# Altium project stm32_mobo_module.PrjPcb
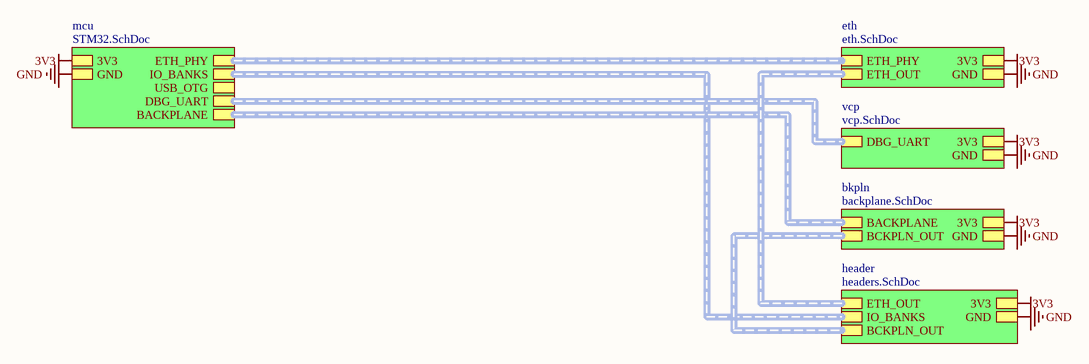
[diagram p0: main.SchDoc]
6 sheets, 84 parts. Net scope: strictly hierarchical (ports join the sheet entries above them; power ports are local).
Board file: main.PcbDoc
Sheets:
  main.SchDoc
    mcu = STM32.SchDoc
    eth = eth.SchDoc
    vcp = vcp.SchDoc
    bkpln = backplane.SchDoc
    header = headers.SchDoc

## Sheet main.SchDoc
size A

### Sub-sheets
bkpln = backplane.SchDoc: 3V3, GND, BACKPLANE (harness BACKPLANE), BCKPLN_OUT (harness BCKPLN_OUT)
eth = eth.SchDoc: ETH_PHY (harness ETH_PHY), 3V3, GND, ETH_OUT (harness ETH_OUT)
header = headers.SchDoc: ETH_OUT (harness ETH_OUT), IO_BANKS (harness IO_BANKS), 3V3, GND, BCKPLN_OUT (harness BCKPLN_OUT)
mcu = STM32.SchDoc: BACKPLANE (harness BACKPLANE), ETH_PHY (harness ETH_PHY), IO_BANKS (harness IO_BANKS), USB_OTG (harness USB_OTG), DBG_UART (harness UART), 3V3, GND
vcp = vcp.SchDoc: 3V3, GND, DBG_UART (harness UART)

### Nets
3V3: sheet mcu/3V3, sheet eth/3V3, sheet vcp/3V3, sheet bkpln/3V3, sheet header/3V3
GND: sheet mcu/GND, sheet eth/GND, sheet vcp/GND, sheet bkpln/GND, sheet header/GND

### Buses and harness runs
harness sheet bkpln/BACKPLANE = sheet mcu/BACKPLANE
harness sheet bkpln/BCKPLN_OUT = sheet header/BCKPLN_OUT
harness sheet eth/ETH_OUT = sheet header/ETH_OUT
harness sheet eth/ETH_PHY = sheet mcu/ETH_PHY
harness sheet header/IO_BANKS = sheet mcu/IO_BANKS
harness sheet mcu/DBG_UART = sheet vcp/DBG_UART

## Sheet STM32.SchDoc
size B
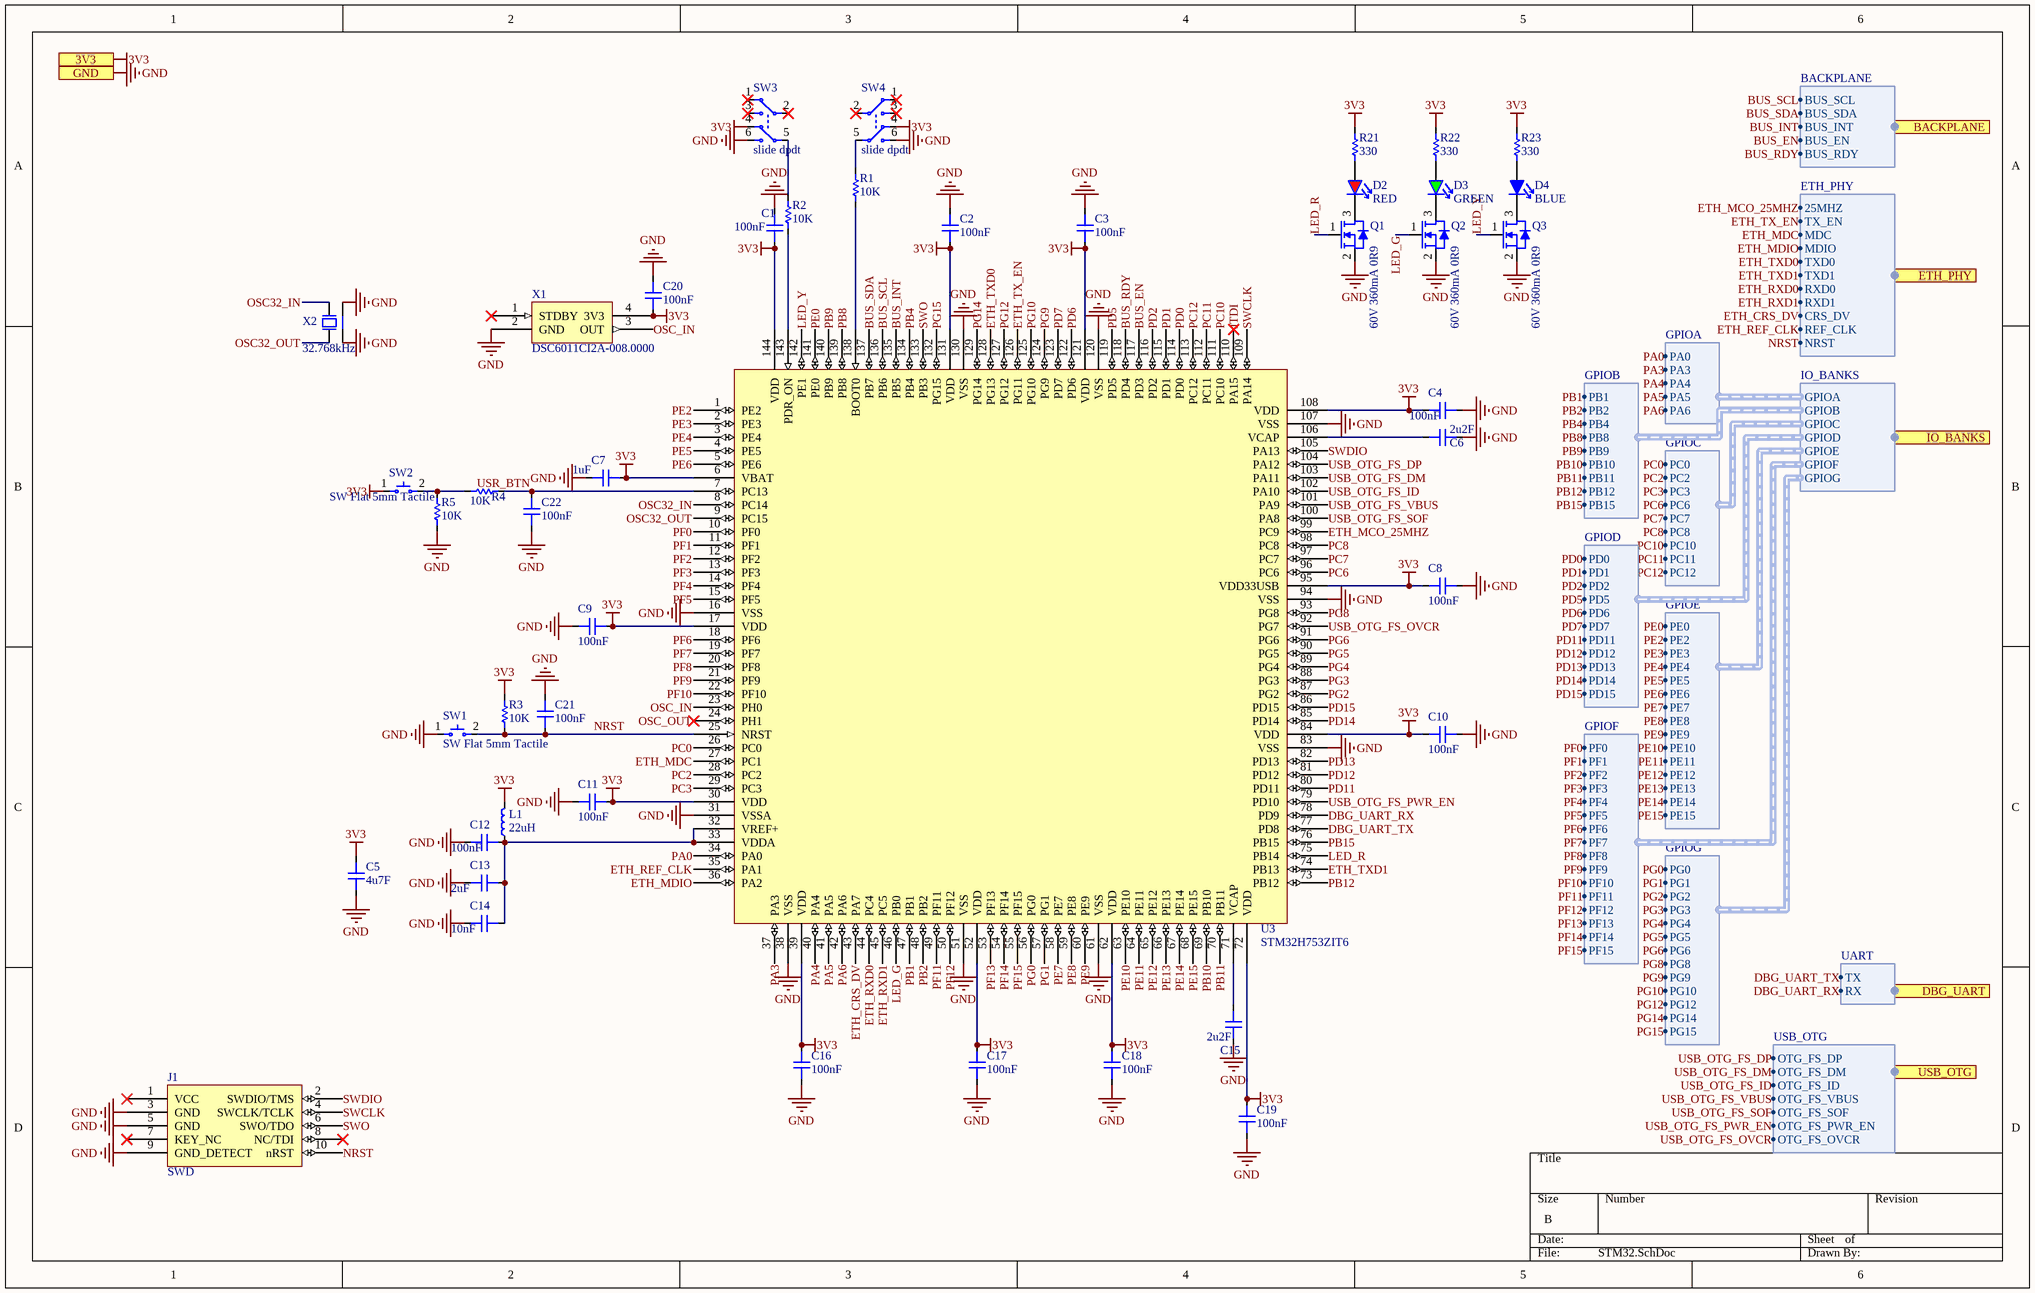
[diagram p1: STM32.SchDoc]

### Parts
C1  100nF  [CAP 0805 L]
C2  100nF  [CAP 0805 L]
C3  100nF  [CAP 0805 L]
C4  100nF  [CAP 0805 L]
C5  4u7F  [CAP 0805 L]
C6  2u2F  [CAP 0805 L]
C7  1uF  [CAP 0805 L]
C8  100nF  [CAP 0805 L]
C9  100nF  [CAP 0805 L]
C10  100nF  [CAP 0805 L]
C11  100nF  [CAP 0805 L]
C12  100nF  [CAP 0805 L]
C13  2uF  [CAP 0805 L]
C14  10nF  [CAP 0805 L]
C15  2u2F  [CAP 0805 L]
C16  100nF  [CAP 0805 L]
C17  100nF  [CAP 0805 L]
C18  100nF  [CAP 0805 L]
C19  100nF  [CAP 0805 L]
C20  100nF  [CAP 0805 L]
C21  100nF  [CAP 0805 L]
C22  100nF  [CAP 0805 L]
D2  RED  [LED 0603 RED]
D3  GREEN  [LED 0603 GREEN]
D4  BLUE  [LED 0603 BLUE]
J1  SWD  [CONN IDC 10P P0.05]
L1  22uH  [IND 0805 L]
Q1  60V 360mA 0R9  [SOT23]
Q2  60V 360mA 0R9  [SOT23]
Q3  60V 360mA 0R9  [SOT23]
R1  10K  [RES 0603 L]
R2  10K  [RES 0603 L]
R3  10K  [RES 0603 L]
R4  10K  [RES 0603 L]
R5  10K  [RES 0603 L]
R21  330  [RES 0603 L]
R22  330  [RES 0603 L]
R23  330  [RES 0603 L]
SW1  SW Flat 5mm Tactile  [SW 5MM TACTILE]
SW2  SW Flat 5mm Tactile  [SW 5MM TACTILE]
SW3  slide dpdt  [SW SIDE SLIDE DPDT]
SW4  slide dpdt  [SW SIDE SLIDE DPDT]
U3  STM32H753ZIT6  [LQFP144]
X1  DSC6011CI2A-008.0000  [XO 3.2x2.5]
X2  32.768kHz  [XTAL 8.0x3.8]

### Ports
3V3, BACKPLANE (harness BACKPLANE), DBG_UART (harness UART), ETH_PHY (harness ETH_PHY), GND, IO_BANKS (harness IO_BANKS), USB_OTG (harness USB_OTG)

### Harnesses
BACKPLANE: BUS_SCL, BUS_SDA, BUS_INT, BUS_EN, BUS_RDY
ETH_PHY: 25MHZ, TX_EN, MDC, MDIO, TXD0, TXD1, RXD0, RXD1, CRS_DV, REF_CLK, NRST
IO_BANKS: GPIOA, GPIOB, GPIOC, GPIOD, GPIOE, GPIOF, GPIOG
GPIOA: PA0, PA3, PA4, PA5, PA6
GPIOB: PB1, PB2, PB4, PB8, PB9, PB10, PB11, PB12, PB15
GPIOC: PC0, PC2, PC3, PC6, PC7, PC8, PC10, PC11, PC12
GPIOD: PD0, PD1, PD2, PD5, PD6, PD7, PD11, PD12, PD13, PD14, PD15
GPIOE: PE0, PE2, PE3, PE4, PE5, PE6, PE7, PE8, PE9, PE10, PE11, PE12, PE13, PE14, PE15
GPIOF: PF0, PF1, PF2, PF3, PF4, PF5, PF6, PF7, PF8, PF9, PF10, PF11, PF12, PF13, PF14, PF15
GPIOG: PG0, PG1, PG2, PG3, PG4, PG5, PG6, PG8, PG9, PG10, PG12, PG14, PG15
USB_OTG: OTG_FS_DP, OTG_FS_DM, OTG_FS_ID, OTG_FS_VBUS, OTG_FS_SOF, OTG_FS_PWR_EN, OTG_FS_OVCR
UART: TX, RX

### Nets
3V3: C1.1 C2.1 C3.1 C4.1 C5.1 C7.2 C8.1 C9.2 C10.1 C11.2 C16.2 C17.2 C18.2 C19.2 C20.1 L1.2 R3.2 R21.2 R22.2 R23.2 SW2.1 SW3.4 SW4.4 U3.6(VBAT) U3.17(VDD) U3.30(VDD) U3.39(VDD) U3.52(VDD) U3.62(VDD) U3.72(VDD) U3.84(VDD) U3.95(VDD33USB) U3.108(VDD) U3.121(VDD) U3.131(VDD) U3.144(VDD) X1.4(3V3) ; port 3V3
GND: C1.2 C2.2 C3.2 C4.2 C5.2 C6.2 C7.1 C8.2 C9.1 C10.2 C11.1 C12.1 C13.1 C14.1 C15.1 C16.1 C17.1 C18.1 C19.1 C20.2 C21.2 C22.1 J1.3(GND) J1.5(GND) J1.9(GND_DETECT) Q1.2 Q2.2 Q3.2 R5.1 SW1.1 SW3.6 SW4.6 U3.16(VSS) U3.31(VSSA) U3.38(VSS) U3.51(VSS) U3.61(VSS) U3.83(VSS) U3.94(VSS) U3.107(VSS) U3.120(VSS) U3.130(VSS) X1.2(GND) X2.2 X2.3 ; port GND
BUS_EN: U3.117(PD3) ; port BACKPLANE.BUS_EN
BUS_INT: U3.135(PB5) ; port BACKPLANE.BUS_INT
BUS_RDY: U3.118(PD4) ; port BACKPLANE.BUS_RDY
BUS_SCL: U3.136(PB6) ; port BACKPLANE.BUS_SCL
BUS_SDA: U3.137(PB7) ; port BACKPLANE.BUS_SDA
DBG_UART_RX: U3.78(PD9) ; port DBG_UART.RX
DBG_UART_TX: U3.77(PD8) ; port DBG_UART.TX
ETH_CRS_DV: U3.43(PA7) ; port ETH_PHY.CRS_DV  [project net CRS_DV]
ETH_MCO_25MHZ: U3.99(PC9) ; port ETH_PHY.25MHZ  [project net 25MHZ]
ETH_MDC: U3.27(PC1) ; port ETH_PHY.MDC
ETH_MDIO: U3.36(PA2) ; port ETH_PHY.MDIO
ETH_REF_CLK: U3.35(PA1) ; port ETH_PHY.REF_CLK
ETH_RXD0: U3.44(PC4) ; port ETH_PHY.RXD0
ETH_RXD1: U3.45(PC5) ; port ETH_PHY.RXD1
ETH_TX_EN: U3.126(PG11) ; port ETH_PHY.TX_EN
ETH_TXD0: U3.128(PG13) ; port ETH_PHY.TXD0
ETH_TXD1: U3.74(PB13) ; port ETH_PHY.TXD1
JTDI: U3.110(PA15)
LED_G: Q2.1 U3.46(PB0)
LED_R: Q1.1 U3.75(PB14)
LED_Y: Q3.1 U3.142(PE1)
NRST: C21.1 J1.10(nRST) R3.1 SW1.2 U3.25(NRST) ; port ETH_PHY.NRST
OSC32_IN: U3.8(PC14) X2.4
OSC32_OUT: U3.9(PC15) X2.1
OSC_IN: U3.23(PH0) X1.3(OUT)
OSC_OUT: U3.24(PH1)
PA0: U3.34(PA0) ; harness GPIOA.PA0
PA3: U3.37(PA3) ; harness GPIOA.PA3
PA4: U3.40(PA4) ; harness GPIOA.PA4
PA5: U3.41(PA5) ; harness GPIOA.PA5
PA6: U3.42(PA6)
PB1: U3.47(PB1) ; harness GPIOB.PB1
PB2: U3.48(PB2) ; harness GPIOB.PB2
PB4: U3.134(PB4) ; harness GPIOB.PB4
PB8: U3.139(PB8) ; harness GPIOB.PB8
PB9: U3.140(PB9) ; harness GPIOB.PB9
PB10: U3.69(PB10) ; harness GPIOB.PB10
PB11: U3.70(PB11) ; harness GPIOB.PB11
PB12: U3.73(PB12) ; harness GPIOB.PB12
PB15: U3.76(PB15) ; harness GPIOB.PB15
PC0: U3.26(PC0) ; harness GPIOC.PC0
PC2: U3.28(PC2) ; harness GPIOC.PC2
PC3: U3.29(PC3) ; harness GPIOC.PC3
PC6: U3.96(PC6) ; harness GPIOC.PC6
PC7: U3.97(PC7) ; harness GPIOC.PC7
PC8: U3.98(PC8) ; harness GPIOC.PC8
PC10: U3.111(PC10) ; harness GPIOC.PC10
PC11: U3.112(PC11) ; harness GPIOC.PC11
PC12: U3.113(PC12) ; harness GPIOC.PC12
PD0: U3.114(PD0) ; harness GPIOD.PD0
PD1: U3.115(PD1) ; harness GPIOD.PD1
PD2: U3.116(PD2) ; harness GPIOD.PD2
PD5: U3.119(PD5) ; harness GPIOD.PD5
PD6: U3.122(PD6) ; harness GPIOD.PD6
PD7: U3.123(PD7) ; harness GPIOD.PD7
PD11: U3.80(PD11) ; harness GPIOD.PD11
PD12: U3.81(PD12) ; harness GPIOD.PD12
PD13: U3.82(PD13) ; harness GPIOD.PD13
PD14: U3.85(PD14) ; harness GPIOD.PD14
PD15: U3.86(PD15) ; harness GPIOD.PD15
PE0: U3.141(PE0) ; harness GPIOE.PE0
PE2: U3.1(PE2) ; harness GPIOE.PE2
PE3: U3.2(PE3) ; harness GPIOE.PE3
PE4: U3.3(PE4) ; harness GPIOE.PE4
PE5: U3.4(PE5) ; harness GPIOE.PE5
PE6: U3.5(PE6) ; harness GPIOE.PE6
PE7: U3.58(PE7) ; harness GPIOE.PE7
PE8: U3.59(PE8) ; harness GPIOE.PE8
PE9: U3.60(PE9) ; harness GPIOE.PE9
PE10: U3.63(PE10) ; harness GPIOE.PE10
PE11: U3.64(PE11) ; harness GPIOE.PE11
PE12: U3.65(PE12) ; harness GPIOE.PE12
PE13: U3.66(PE13) ; harness GPIOE.PE13
PE14: U3.67(PE14) ; harness GPIOE.PE14
PE15: U3.68(PE15) ; harness GPIOE.PE15
PF0: U3.10(PF0) ; harness GPIOF.PF0
PF1: U3.11(PF1) ; harness GPIOF.PF1
PF2: U3.12(PF2) ; harness GPIOF.PF2
PF3: U3.13(PF3) ; harness GPIOF.PF3
PF4: U3.14(PF4) ; harness GPIOF.PF4
PF5: U3.15(PF5) ; harness GPIOF.PF5
PF6: U3.18(PF6) ; harness GPIOF.PF6
PF7: U3.19(PF7) ; harness GPIOF.PF7
PF8: U3.20(PF8) ; harness GPIOF.PF8
PF9: U3.21(PF9) ; harness GPIOF.PF9
PF10: U3.22(PF10) ; harness GPIOF.PF10
PF11: U3.49(PF11) ; harness GPIOF.PF11
PF12: U3.50(PF12) ; harness GPIOF.PF12
PF13: U3.53(PF13) ; harness GPIOF.PF13
PF14: U3.54(PF14) ; harness GPIOF.PF14
PF15: U3.55(PF15) ; harness GPIOF.PF15
PG0: U3.56(PG0) ; harness GPIOG.PG0
PG1: U3.57(PG1) ; harness GPIOG.PG1
PG2: U3.87(PG2) ; harness GPIOG.PG2
PG3: U3.88(PG3) ; harness GPIOG.PG3
PG4: U3.89(PG4) ; harness GPIOG.PG4
PG5: U3.90(PG5) ; harness GPIOG.PG5
PG6: U3.91(PG6) ; harness GPIOG.PG6
PG8: U3.93(PG8) ; harness GPIOG.PG8
PG9: U3.124(PG9) ; harness GPIOG.PG9
PG10: U3.125(PG10) ; harness GPIOG.PG10
PG12: U3.127(PG12) ; harness GPIOG.PG12
PG14: U3.129(PG14) ; harness GPIOG.PG14
PG15: U3.132(PG15) ; harness GPIOG.PG15
SWCLK: J1.4(SWCLK/TCLK) U3.109(PA14)
SWDIO: J1.2(SWDIO/TMS) U3.105(PA13)
SWO: J1.6(SWO/TDO) U3.133(PB3)
USB_OTG_FS_DM: U3.103(PA11) ; port USB_OTG.OTG_FS_DM
USB_OTG_FS_DP: U3.104(PA12) ; port USB_OTG.OTG_FS_DP
USB_OTG_FS_ID: U3.102(PA10) ; port USB_OTG.OTG_FS_ID
USB_OTG_FS_OVCR: U3.92(PG7) ; port USB_OTG.OTG_FS_OVCR
USB_OTG_FS_PWR_EN: U3.79(PD10) ; port USB_OTG.OTG_FS_PWR_EN
USB_OTG_FS_SOF: U3.100(PA8) ; port USB_OTG.OTG_FS_SOF
USB_OTG_FS_VBUS: U3.101(PA9) ; port USB_OTG.OTG_FS_VBUS
USR_BTN: C22.2 R4.1 U3.7(PC13)
NetC6_1: C6.1 U3.106(VCAP)
NetC12_2: C12.2 C13.2 C14.2 L1.1 U3.32(VREF+) U3.33(VDDA)
NetC15_2: C15.2 U3.71(VCAP)
NetD2_1: D2.1 Q1.3
NetD2_2: D2.2 R21.1
NetD3_1: D3.1 Q2.3
NetD3_2: D3.2 R22.1
NetD4_1: D4.1 Q3.3
NetD4_2: D4.2 R23.1
NetR1_1: R1.1 U3.138(BOOT0)
NetR1_2: R1.2 SW4.5
NetR2_1: R2.1 U3.143(PDR_ON)
NetR2_2: R2.2 SW3.5
NetR4_2: R4.2 R5.2 SW2.2

Not connected (* = marked no-connect by the designer): J1 1(VCC)* 7(KEY_NC)* 8(NC/TDI)*; SW3 1* 2* 3*; SW4 1* 2* 3*; X1 1(STDBY)*

### Notes on the sheet
- Labels drawn without touching a wire or pin: PA6

### Library data of the parts
C1-C22 = CAP 0805
D2 = LED 0603 RED
D3 = LED 0603 GREEN
D4 = LED 0603 BLUE
J1 = CONN SWD IDC 0.05: Supplier 1: Digi-Key; Supplier Part Number 1: 1175-1735-ND
L1 = IND 0805
Q1-Q3 = FET 60V 360mA 0R9: PMN20ENAX; Supplier 1: Digi-Key; Supplier Part Number 1: 1727-1142-1-ND
R1-R5 R21-R23 = RES 0603
SW3 SW4 = SW horz slide dpdt: JS202011JAQN; Supplier 1: Digi-Key; Supplier Part Number 1: CKN10722CT-ND
X1 = XO MEMS 8MHz
X2 = XTAL 32.768kHz: RSM200S-32.768-12.5-10PPM-NPB

## Sheet eth.SchDoc
size A
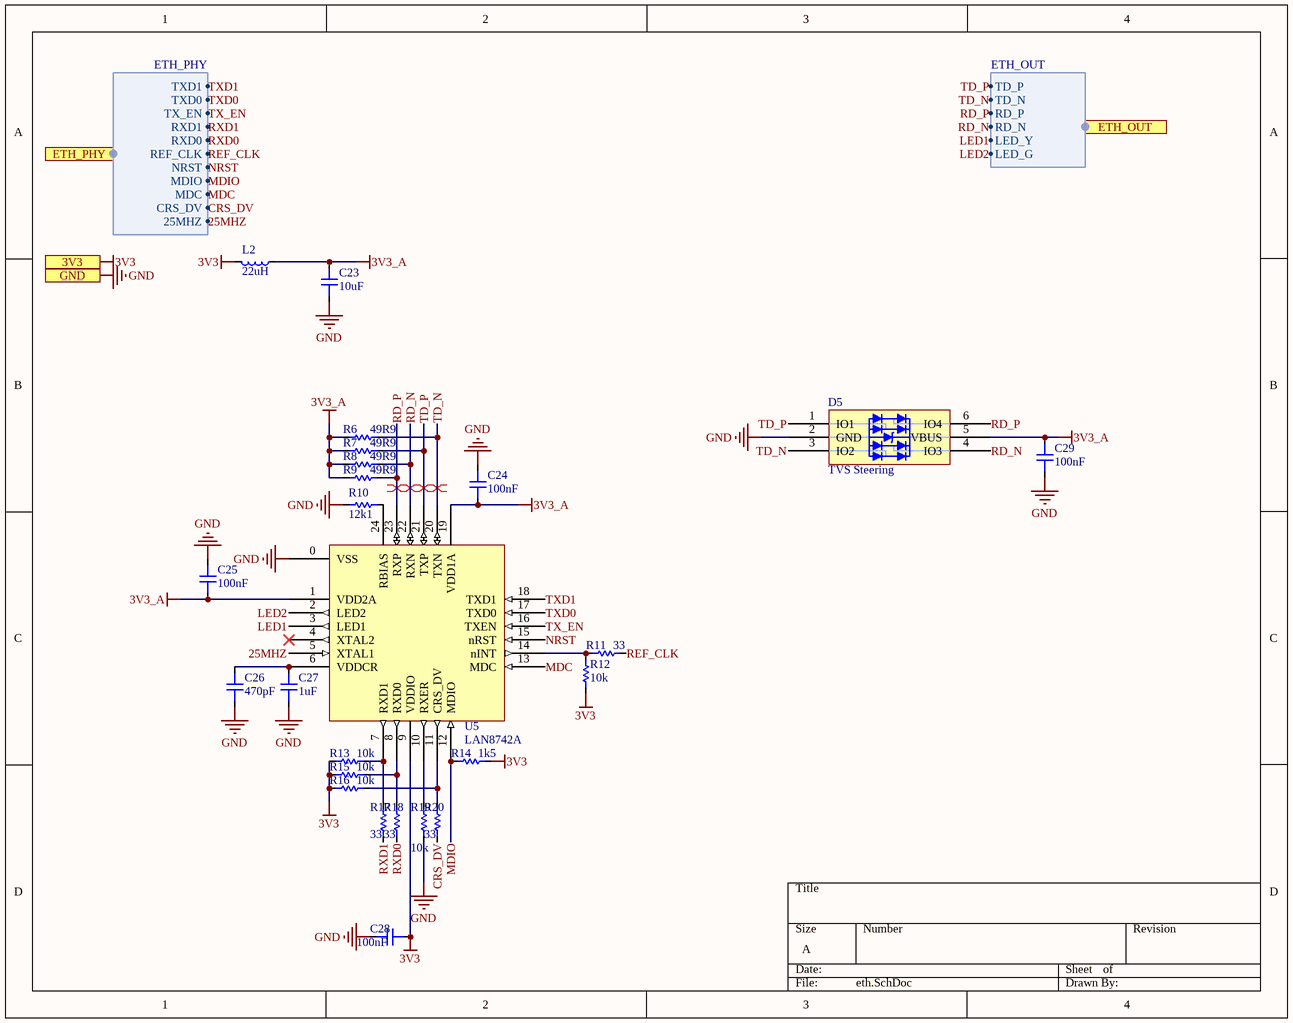
[diagram p2: eth.SchDoc]

### Parts
C23  10uF  [CAP 0805 L]
C24  100nF  [CAP 0805 L]
C25  100nF  [CAP 0805 L]
C26  470pF  [CAP 0805 L]
C27  1uF  [CAP 0805 L]
C28  100nF  [CAP 0805 L]
C29  100nF  [CAP 0805 L]
D5  TVS Steering  [SC-74]
L2  22uH  [IND 0805 L]
R6  49R9  [RES 0603 L]
R7  49R9  [RES 0603 L]
R8  49R9  [RES 0603 L]
R9  49R9  [RES 0603 L]
R10  12k1  [RES 0603 L]
R11  33  [RES 0603 L]
R12  10k  [RES 0603 L]
R13  10k  [RES 0603 L]
R14  1k5  [RES 0603 L]
R15  10k  [RES 0603 L]
R16  10k  [RES 0603 L]
R17  33  [RES 0603 L]
R18  33  [RES 0603 L]
R19  10k  [RES 0603 L]
R20  33  [RES 0603 L]
U5  LAN8742A  [VQFN24]

### Ports
3V3, ETH_OUT (harness ETH_OUT), ETH_PHY (harness ETH_PHY), GND

### Harnesses
ETH_PHY: 25MHZ, CRS_DV, MDC, MDIO, NRST, REF_CLK, RXD0, RXD1, TX_EN, TXD0, TXD1
ETH_OUT: TD_P, TD_N, RD_P, RD_N, LED_Y, LED_G

### Nets
3V3: C28.2 L2.2 R12.2 R13.2 R14.1 R15.2 R16.2 U5.9(VDDIO) ; port 3V3
3V3_A: C23.2 C24.1 C25.1 C29.2 D5.5(VBUS) L2.1 R6.2 R7.2 R8.2 R9.2 U5.1(VDD2A) U5.19(VDD1A)
GND: C23.1 C24.2 C25.2 C26.1 C27.1 C28.1 C29.1 D5.2(GND) R10.1 R19.1 U5.0(VSS) ; port GND
25MHZ: U5.5(XTAL1) ; port ETH_PHY.25MHZ
CRS_DV: R20.1 ; port ETH_PHY.CRS_DV
LED1: U5.3(LED1) ; port ETH_OUT.LED_Y
LED2: U5.2(LED2) ; port ETH_OUT.LED_G
MDC: U5.13(MDC) ; port ETH_PHY.MDC  [project net ETH_MDC]
MDIO: R14.2 U5.12(MDIO) ; port ETH_PHY.MDIO  [project net ETH_MDIO]
NRST: U5.15(nRST) ; port ETH_PHY.NRST
RD_N: D5.4(IO3) R8.1 U5.22(RXN) ; port ETH_OUT.RD_N
RD_P: D5.6(IO4) R9.1 U5.23(RXP) ; port ETH_OUT.RD_P
REF_CLK: R11.1 ; port ETH_PHY.REF_CLK  [project net ETH_REF_CLK]
RXD0: R18.1 ; port ETH_PHY.RXD0  [project net ETH_RXD0]
RXD1: R17.1 ; port ETH_PHY.RXD1  [project net ETH_RXD1]
TD_N: D5.3(IO2) R6.1 U5.20(TXN) ; port ETH_OUT.TD_N
TD_P: D5.1(IO1) R7.1 U5.21(TXP) ; port ETH_OUT.TD_P
TX_EN: U5.16(TXEN) ; port ETH_PHY.TX_EN  [project net ETH_TX_EN]
TXD0: U5.17(TXD0) ; port ETH_PHY.TXD0  [project net ETH_TXD0]
TXD1: U5.18(TXD1) ; port ETH_PHY.TXD1  [project net ETH_TXD1]
NetC26_2: C26.2 C27.2 U5.6(VDDCR)
NetR10_2: R10.2 U5.24(RBIAS)
NetR11_2: R11.2 R12.1 U5.14(nINT)
NetR13_1: R13.1 R17.2 U5.7(RXD1)
NetR15_1: R15.1 R18.2 U5.8(RXD0)
NetR16_1: R16.1 R20.2 U5.11(CRS_DV)
NetR19_2: R19.2 U5.10(RXER)

Not connected (* = marked no-connect by the designer): U5 4(XTAL2)*

### Layout directives
differential pair: RD_N, RD_P, TD_N, TD_P

### Library data of the parts
C23-C29 = CAP 0805
D5 = DTVS 2Rail 4x: CM1293A-04SO; Supplier 1: Digi-Key; Supplier Part Number 1: CM1293A-04SOOSCT-ND
L2 = IND 0805
R6-R20 = RES 0603
U5 = IC ETH PHY RMII: LAN8742A-CZ-TR / LAN8742AI-CZ-TR

## Sheet vcp.SchDoc
size A
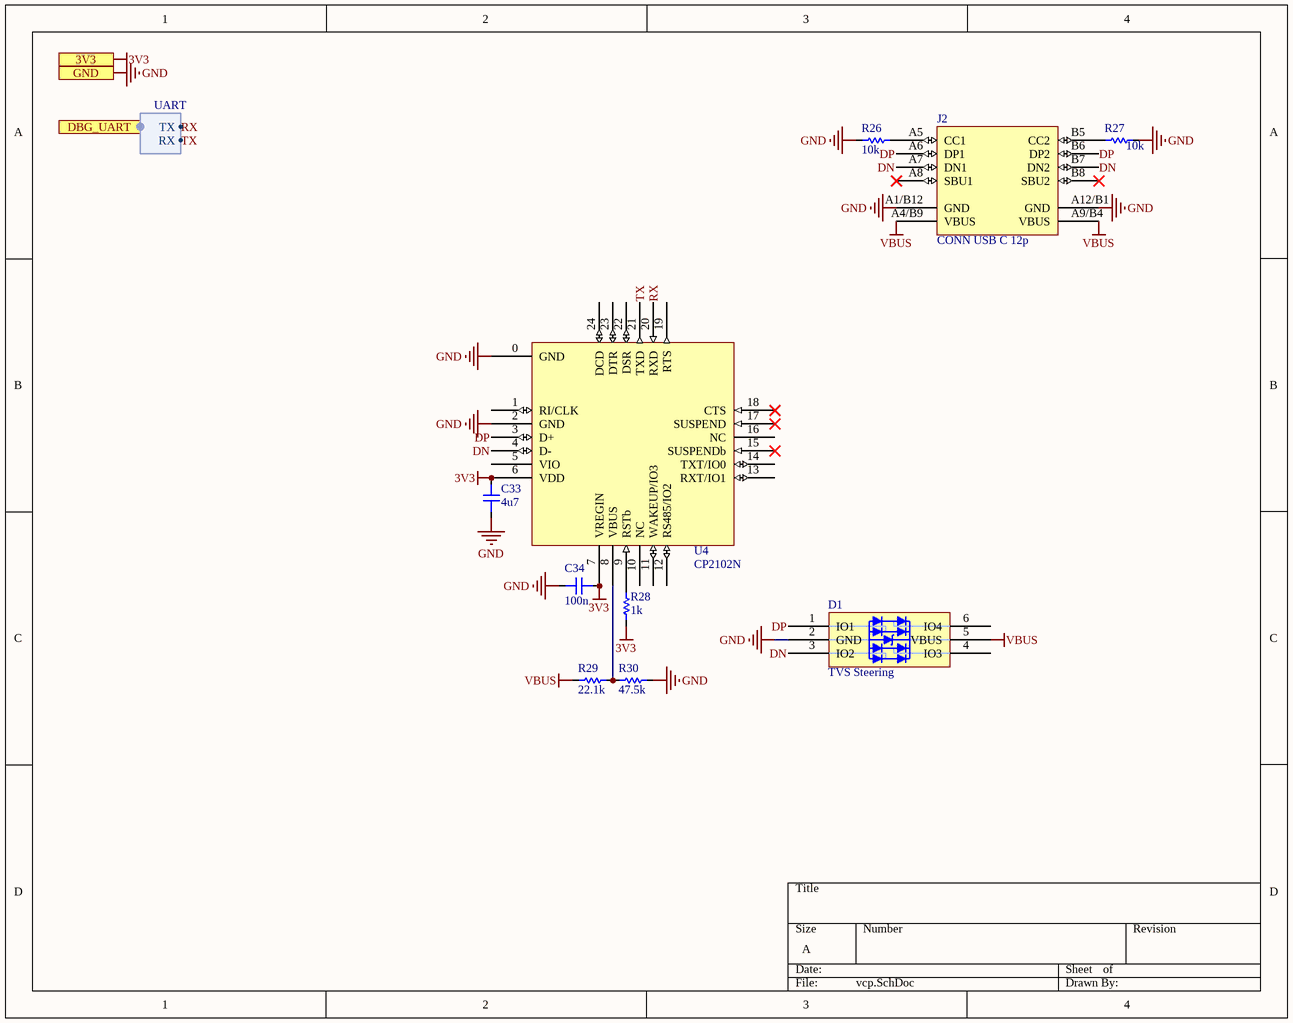
[diagram p3: vcp.SchDoc]

### Parts
C33  4u7  [CAP 0805 L]
C34  100n  [CAP 0805 L]
D1  TVS Steering  [SC-74]
J2  CONN USB C 12p  [CONN USB C 12P]
R26  10k  [RES 0603 L]
R27  10k  [RES 0603 L]
R28  1k  [RES 0603 L]
R29  22.1k  [RES 0603 L]
R30  47.5k  [RES 0603 L]
U4  CP2102N  [VQFN24]

### Ports
3V3, DBG_UART (harness UART), GND

### Harnesses
UART: RX, TX

### Nets
3V3: C33.2 C34.2 R28.1 U4.6(VDD) U4.7(VREGIN) ; port 3V3
GND: C33.1 C34.1 D1.2(GND) J2.A1/B12(GND) J2.A12/B1(GND) R26.2 R27.1 R30.2 U4.0(GND) U4.2(GND) ; port GND
VBUS: D1.5(VBUS) J2.A4/B9(VBUS) J2.A9/B4(VBUS) R29.1
DN: D1.3(IO2) J2.A7(DN1) J2.B7(DN2) U4.4(D-)
DP: D1.1(IO1) J2.A6(DP1) J2.B6(DP2) U4.3(D+)
RX: U4.20(RXD) ; port DBG_UART.TX  [project net DBG_UART_TX]
TX: U4.21(TXD) ; port DBG_UART.RX  [project net DBG_UART_RX]
NetJ2_A5: J2.A5(CC1) R26.1
NetJ2_B5: J2.B5(CC2) R27.2
NetR28_2: R28.2 U4.9(RSTb)
NetR29_2: R29.2 R30.1 U4.8(VBUS)

Not connected (* = marked no-connect by the designer): D1 4(IO3) 6(IO4); J2 A8(SBU1)* B8(SBU2)*; U4 1(RI/CLK) 5(VIO) 10(NC) 11(WAKEUP/IO3) 12(RS485/IO2) 13(RXT/IO1) 14(TXT/IO0) 15(SUSPENDb)* 16(NC) 17(SUSPEND)* 18(CTS)* 19(RTS) 22(DSR) 23(DTR) 24(DCD)

### Library data of the parts
C33 C34 = CAP 0805
D1 = DTVS 2Rail 4x: CM1293A-04SO; Supplier 1: Digi-Key; Supplier Part Number 1: CM1293A-04SOOSCT-ND
J2 = CONN USB C 12p: USB - Type C Female 12 SMD USB Connectors RoHS; LCSC Part #: C167321
R26-R30 = RES 0603
U4 = IC USB UART CP2102N: Supplier 1: Digi-Key; Supplier Part Number 1: 336-5888-1-ND

## Sheet backplane.SchDoc
size A
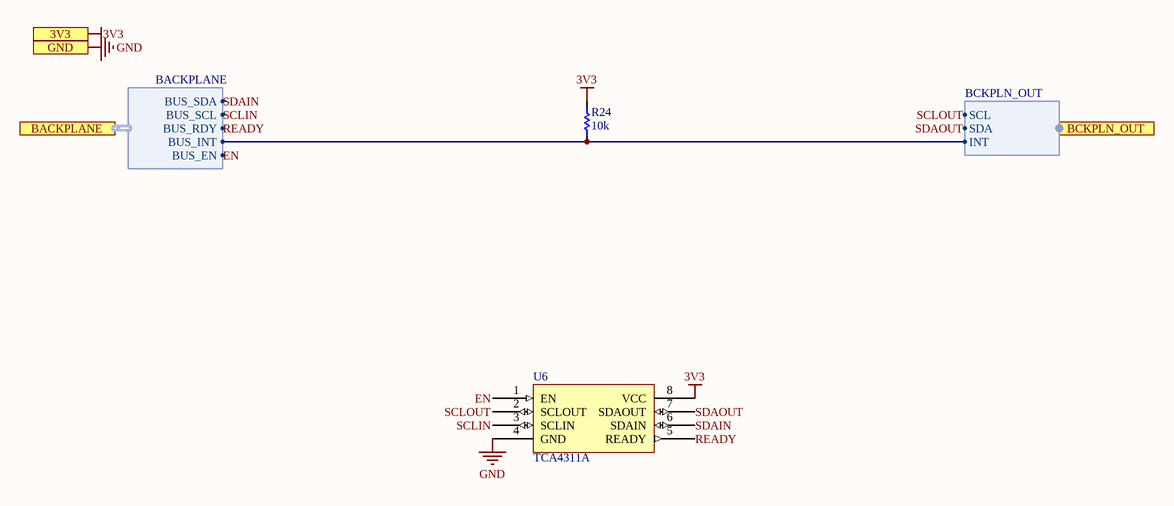
[diagram p4: backplane.SchDoc]

### Parts
R24  10k  [RES 0603 L]
U6  TCA4311A  [SSOP-8]

### Ports
3V3, BACKPLANE (harness BACKPLANE), BCKPLN_OUT (harness BCKPLN_OUT), GND

### Harnesses
BACKPLANE: BUS_EN, BUS_INT, BUS_RDY, BUS_SCL, BUS_SDA
BCKPLN_OUT: SCL, SDA, INT

### Nets
3V3: R24.2 U6.8(VCC) ; port 3V3
GND: U6.4(GND) ; port GND
BUS_INT: R24.1 ; port BACKPLANE.BUS_INT, port BCKPLN_OUT.INT
EN: U6.1(EN) ; port BACKPLANE.BUS_EN  [project net BUS_EN]
READY: U6.5(READY) ; port BACKPLANE.BUS_RDY  [project net BUS_RDY]
SCLIN: U6.3(SCLIN) ; port BACKPLANE.BUS_SCL  [project net BUS_SCL]
SCLOUT: U6.2(SCLOUT) ; port BCKPLN_OUT.SCL
SDAIN: U6.6(SDAIN) ; port BACKPLANE.BUS_SDA  [project net BUS_SDA]
SDAOUT: U6.7(SDAOUT) ; port BCKPLN_OUT.SDA

### Library data of the parts
R24 = RES 0603
U6 = IC I2C HOTSWAP BUF: Supplier 1: Digi-Key; Supplier Part Number 1: 296-28328-1-ND

## Sheet headers.SchDoc
size A
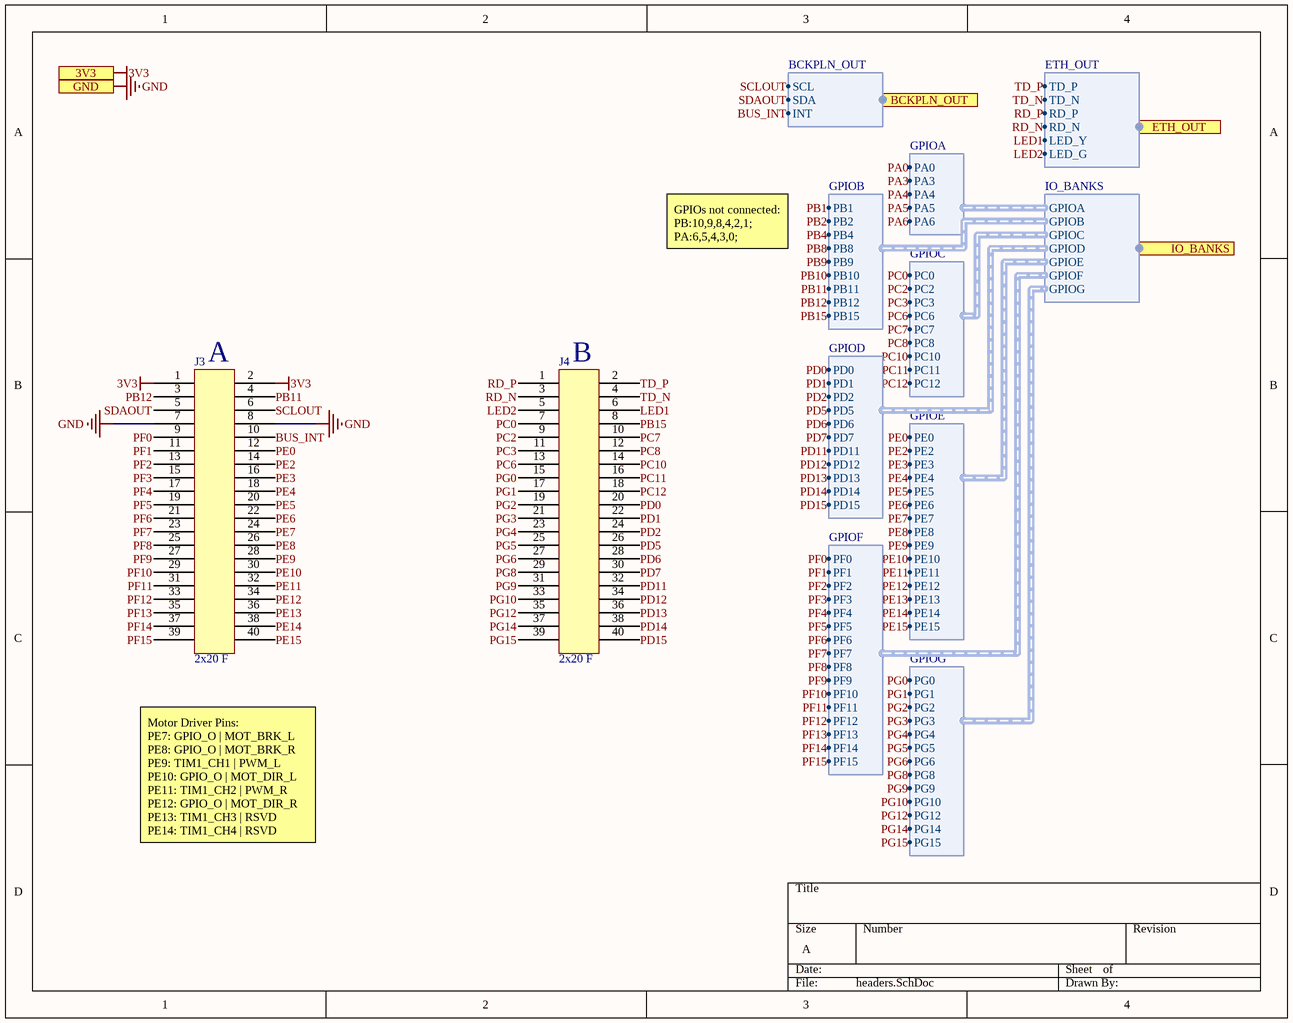
[diagram p5: headers.SchDoc]

### Parts
J3  2x20 F  [CONN HDR 2x20 F BOT]
J4  2x20 F  [CONN HDR 2x20 F BOT]

### Ports
3V3, BCKPLN_OUT (harness BCKPLN_OUT), ETH_OUT (harness ETH_OUT), GND, IO_BANKS (harness IO_BANKS)

### Harnesses
ETH_OUT: TD_P, TD_N, RD_P, RD_N, LED_Y, LED_G
IO_BANKS: GPIOA, GPIOB, GPIOC, GPIOD, GPIOE, GPIOF, GPIOG
GPIOA: PA0, PA3, PA4, PA5, PA6
GPIOB: PB1, PB2, PB4, PB8, PB9, PB10, PB11, PB12, PB15
GPIOC: PC0, PC2, PC3, PC6, PC7, PC8, PC10, PC11, PC12
GPIOD: PD0, PD1, PD2, PD5, PD6, PD7, PD11, PD12, PD13, PD14, PD15
GPIOE: PE0, PE2, PE3, PE4, PE5, PE6, PE7, PE8, PE9, PE10, PE11, PE12, PE13, PE14, PE15
GPIOF: PF0, PF1, PF2, PF3, PF4, PF5, PF6, PF7, PF8, PF9, PF10, PF11, PF12, PF13, PF14, PF15
GPIOG: PG0, PG1, PG2, PG3, PG4, PG5, PG6, PG8, PG9, PG10, PG12, PG14, PG15
BCKPLN_OUT: SCL, SDA, INT

### Nets
3V3: J3.1 J3.2 ; port 3V3
GND: J3.7 J3.8 ; port GND
BUS_INT: J3.10 ; port BCKPLN_OUT.INT
LED1: J4.6 ; port ETH_OUT.LED_Y
LED2: J4.5 ; port ETH_OUT.LED_G
PB11: J3.4 ; harness GPIOB.PB11
PB12: J3.3 ; harness GPIOB.PB12
PB15: J4.8 ; harness GPIOB.PB15
PC0: J4.7 ; harness GPIOC.PC0
PC2: J4.9 ; harness GPIOC.PC2
PC3: J4.11 ; harness GPIOC.PC3
PC6: J4.13 ; harness GPIOC.PC6
PC7: J4.10 ; harness GPIOC.PC7
PC8: J4.12 ; harness GPIOC.PC8
PC10: J4.14 ; harness GPIOC.PC10
PC11: J4.16 ; harness GPIOC.PC11
PC12: J4.18 ; harness GPIOC.PC12
PD0: J4.20 ; harness GPIOD.PD0
PD1: J4.22 ; harness GPIOD.PD1
PD2: J4.24 ; harness GPIOD.PD2
PD5: J4.26 ; harness GPIOD.PD5
PD6: J4.28 ; harness GPIOD.PD6
PD7: J4.30 ; harness GPIOD.PD7
PD11: J4.32 ; harness GPIOD.PD11
PD12: J4.34 ; harness GPIOD.PD12
PD13: J4.36 ; harness GPIOD.PD13
PD14: J4.38 ; harness GPIOD.PD14
PD15: J4.40 ; harness GPIOD.PD15
PE0: J3.12 ; harness GPIOE.PE0
PE2: J3.14 ; harness GPIOE.PE2
PE3: J3.16 ; harness GPIOE.PE3
PE4: J3.18 ; harness GPIOE.PE4
PE5: J3.20 ; harness GPIOE.PE5
PE6: J3.22 ; harness GPIOE.PE6
PE7: J3.24 ; harness GPIOE.PE7
PE8: J3.26 ; harness GPIOE.PE8
PE9: J3.28 ; harness GPIOE.PE9
PE10: J3.30 ; harness GPIOE.PE10
PE11: J3.32 ; harness GPIOE.PE11
PE12: J3.34 ; harness GPIOE.PE12
PE13: J3.36 ; harness GPIOE.PE13
PE14: J3.38 ; harness GPIOE.PE14
PE15: J3.40 ; harness GPIOE.PE15
PF0: J3.9 ; harness GPIOF.PF0
PF1: J3.11 ; harness GPIOF.PF1
PF2: J3.13 ; harness GPIOF.PF2
PF3: J3.15 ; harness GPIOF.PF3
PF4: J3.17 ; harness GPIOF.PF4
PF5: J3.19 ; harness GPIOF.PF5
PF6: J3.21 ; harness GPIOF.PF6
PF7: J3.23 ; harness GPIOF.PF7
PF8: J3.25 ; harness GPIOF.PF8
PF9: J3.27 ; harness GPIOF.PF9
PF10: J3.29 ; harness GPIOF.PF10
PF11: J3.31 ; harness GPIOF.PF11
PF12: J3.33 ; harness GPIOF.PF12
PF13: J3.35 ; harness GPIOF.PF13
PF14: J3.37 ; harness GPIOF.PF14
PF15: J3.39 ; harness GPIOF.PF15
PG0: J4.15 ; harness GPIOG.PG0
PG1: J4.17 ; harness GPIOG.PG1
PG2: J4.19 ; harness GPIOG.PG2
PG3: J4.21 ; harness GPIOG.PG3
PG4: J4.23 ; harness GPIOG.PG4
PG5: J4.25 ; harness GPIOG.PG5
PG6: J4.27 ; harness GPIOG.PG6
PG8: J4.29 ; harness GPIOG.PG8
PG9: J4.31 ; harness GPIOG.PG9
PG10: J4.33 ; harness GPIOG.PG10
PG12: J4.35 ; harness GPIOG.PG12
PG14: J4.37 ; harness GPIOG.PG14
PG15: J4.39 ; harness GPIOG.PG15
RD_N: J4.3 ; port ETH_OUT.RD_N
RD_P: J4.1 ; port ETH_OUT.RD_P
SCLOUT: J3.6 ; port BCKPLN_OUT.SCL
SDAOUT: J3.5 ; port BCKPLN_OUT.SDA
TD_N: J4.4 ; port ETH_OUT.TD_N
TD_P: J4.2 ; port ETH_OUT.TD_P

### Notes on the sheet
- GPIOs not connected:
  PB:10,9,8,4,2,1;
  PA:6,5,4,3,0;
- (near J3) A
- (near J4) B
- Motor Driver Pins:
  PE7: GPIO_O | MOT_BRK_L
  PE8: GPIO_O | MOT_BRK_R
  PE9: TIM1_CH1 | PWM_L
  PE10: GPIO_O | MOT_DIR_L
  PE11: TIM1_CH2 | PWM_R
  PE12: GPIO_O | MOT_DIR_R
  PE13: TIM1_CH3 | RSVD
  PE14: TIM1_CH4 | RSVD
- Labels drawn without touching a wire or pin: PA6

### Library data of the parts
J3 J4 = CONN Header 2x20 F: Supplier 1: Digi-Key; Supplier Part Number 1: S9200-ND

## Nets that join several sheets
3V3: STM32 (37 pins), eth (8 pins), vcp (5 pins), backplane (R24.2 U6.8), headers (J3.1 J3.2)
GND: STM32 (45 pins), eth (11 pins), vcp (10 pins), backplane (U6.4), headers (J3.7 J3.8)
25MHZ: STM32 (U3.99), eth (U5.5)
BUS_EN: STM32 (U3.117), backplane (U6.1)
BUS_INT: STM32 (U3.135), backplane (R24.1), headers (J3.10)
BUS_RDY: STM32 (U3.118), backplane (U6.5)
BUS_SCL: STM32 (U3.136), backplane (U6.3)
BUS_SDA: STM32 (U3.137), backplane (U6.6)
CRS_DV: STM32 (U3.43), eth (R20.1)
DBG_UART_RX: STM32 (U3.78), vcp (U4.21)
DBG_UART_TX: STM32 (U3.77), vcp (U4.20)
ETH_MDC: STM32 (U3.27), eth (U5.13)
ETH_MDIO: STM32 (U3.36), eth (R14.2 U5.12)
ETH_REF_CLK: STM32 (U3.35), eth (R11.1)
ETH_RXD0: STM32 (U3.44), eth (R18.1)
ETH_RXD1: STM32 (U3.45), eth (R17.1)
ETH_TX_EN: STM32 (U3.126), eth (U5.16)
ETH_TXD0: STM32 (U3.128), eth (U5.17)
ETH_TXD1: STM32 (U3.74), eth (U5.18)
LED1: eth (U5.3), headers (J4.6)
LED2: eth (U5.2), headers (J4.5)
NRST: STM32 (5 pins), eth (U5.15)
PB11: STM32 (U3.70), headers (J3.4)
PB12: STM32 (U3.73), headers (J3.3)
PB15: STM32 (U3.76), headers (J4.8)
PC0: STM32 (U3.26), headers (J4.7)
PC2: STM32 (U3.28), headers (J4.9)
PC3: STM32 (U3.29), headers (J4.11)
PC6: STM32 (U3.96), headers (J4.13)
PC7: STM32 (U3.97), headers (J4.10)
PC8: STM32 (U3.98), headers (J4.12)
PC10: STM32 (U3.111), headers (J4.14)
PC11: STM32 (U3.112), headers (J4.16)
PC12: STM32 (U3.113), headers (J4.18)
PD0: STM32 (U3.114), headers (J4.20)
PD1: STM32 (U3.115), headers (J4.22)
PD2: STM32 (U3.116), headers (J4.24)
PD5: STM32 (U3.119), headers (J4.26)
PD6: STM32 (U3.122), headers (J4.28)
PD7: STM32 (U3.123), headers (J4.30)
PD11: STM32 (U3.80), headers (J4.32)
PD12: STM32 (U3.81), headers (J4.34)
PD13: STM32 (U3.82), headers (J4.36)
PD14: STM32 (U3.85), headers (J4.38)
PD15: STM32 (U3.86), headers (J4.40)
PE0: STM32 (U3.141), headers (J3.12)
PE2: STM32 (U3.1), headers (J3.14)
PE3: STM32 (U3.2), headers (J3.16)
PE4: STM32 (U3.3), headers (J3.18)
PE5: STM32 (U3.4), headers (J3.20)
PE6: STM32 (U3.5), headers (J3.22)
PE7: STM32 (U3.58), headers (J3.24)
PE8: STM32 (U3.59), headers (J3.26)
PE9: STM32 (U3.60), headers (J3.28)
PE10: STM32 (U3.63), headers (J3.30)
PE11: STM32 (U3.64), headers (J3.32)
PE12: STM32 (U3.65), headers (J3.34)
PE13: STM32 (U3.66), headers (J3.36)
PE14: STM32 (U3.67), headers (J3.38)
PE15: STM32 (U3.68), headers (J3.40)
PF0: STM32 (U3.10), headers (J3.9)
PF1: STM32 (U3.11), headers (J3.11)
PF2: STM32 (U3.12), headers (J3.13)
PF3: STM32 (U3.13), headers (J3.15)
PF4: STM32 (U3.14), headers (J3.17)
PF5: STM32 (U3.15), headers (J3.19)
PF6: STM32 (U3.18), headers (J3.21)
PF7: STM32 (U3.19), headers (J3.23)
PF8: STM32 (U3.20), headers (J3.25)
PF9: STM32 (U3.21), headers (J3.27)
PF10: STM32 (U3.22), headers (J3.29)
PF11: STM32 (U3.49), headers (J3.31)
PF12: STM32 (U3.50), headers (J3.33)
PF13: STM32 (U3.53), headers (J3.35)
PF14: STM32 (U3.54), headers (J3.37)
PF15: STM32 (U3.55), headers (J3.39)
PG0: STM32 (U3.56), headers (J4.15)
PG1: STM32 (U3.57), headers (J4.17)
PG2: STM32 (U3.87), headers (J4.19)
PG3: STM32 (U3.88), headers (J4.21)
PG4: STM32 (U3.89), headers (J4.23)
PG5: STM32 (U3.90), headers (J4.25)
PG6: STM32 (U3.91), headers (J4.27)
PG8: STM32 (U3.93), headers (J4.29)
PG9: STM32 (U3.124), headers (J4.31)
PG10: STM32 (U3.125), headers (J4.33)
PG12: STM32 (U3.127), headers (J4.35)
PG14: STM32 (U3.129), headers (J4.37)
PG15: STM32 (U3.132), headers (J4.39)
RD_N: eth (D5.4 R8.1 U5.22), headers (J4.3)
RD_P: eth (D5.6 R9.1 U5.23), headers (J4.1)
SCLOUT: backplane (U6.2), headers (J3.6)
SDAOUT: backplane (U6.7), headers (J3.5)
TD_N: eth (D5.3 R6.1 U5.20), headers (J4.4)
TD_P: eth (D5.1 R7.1 U5.21), headers (J4.2)